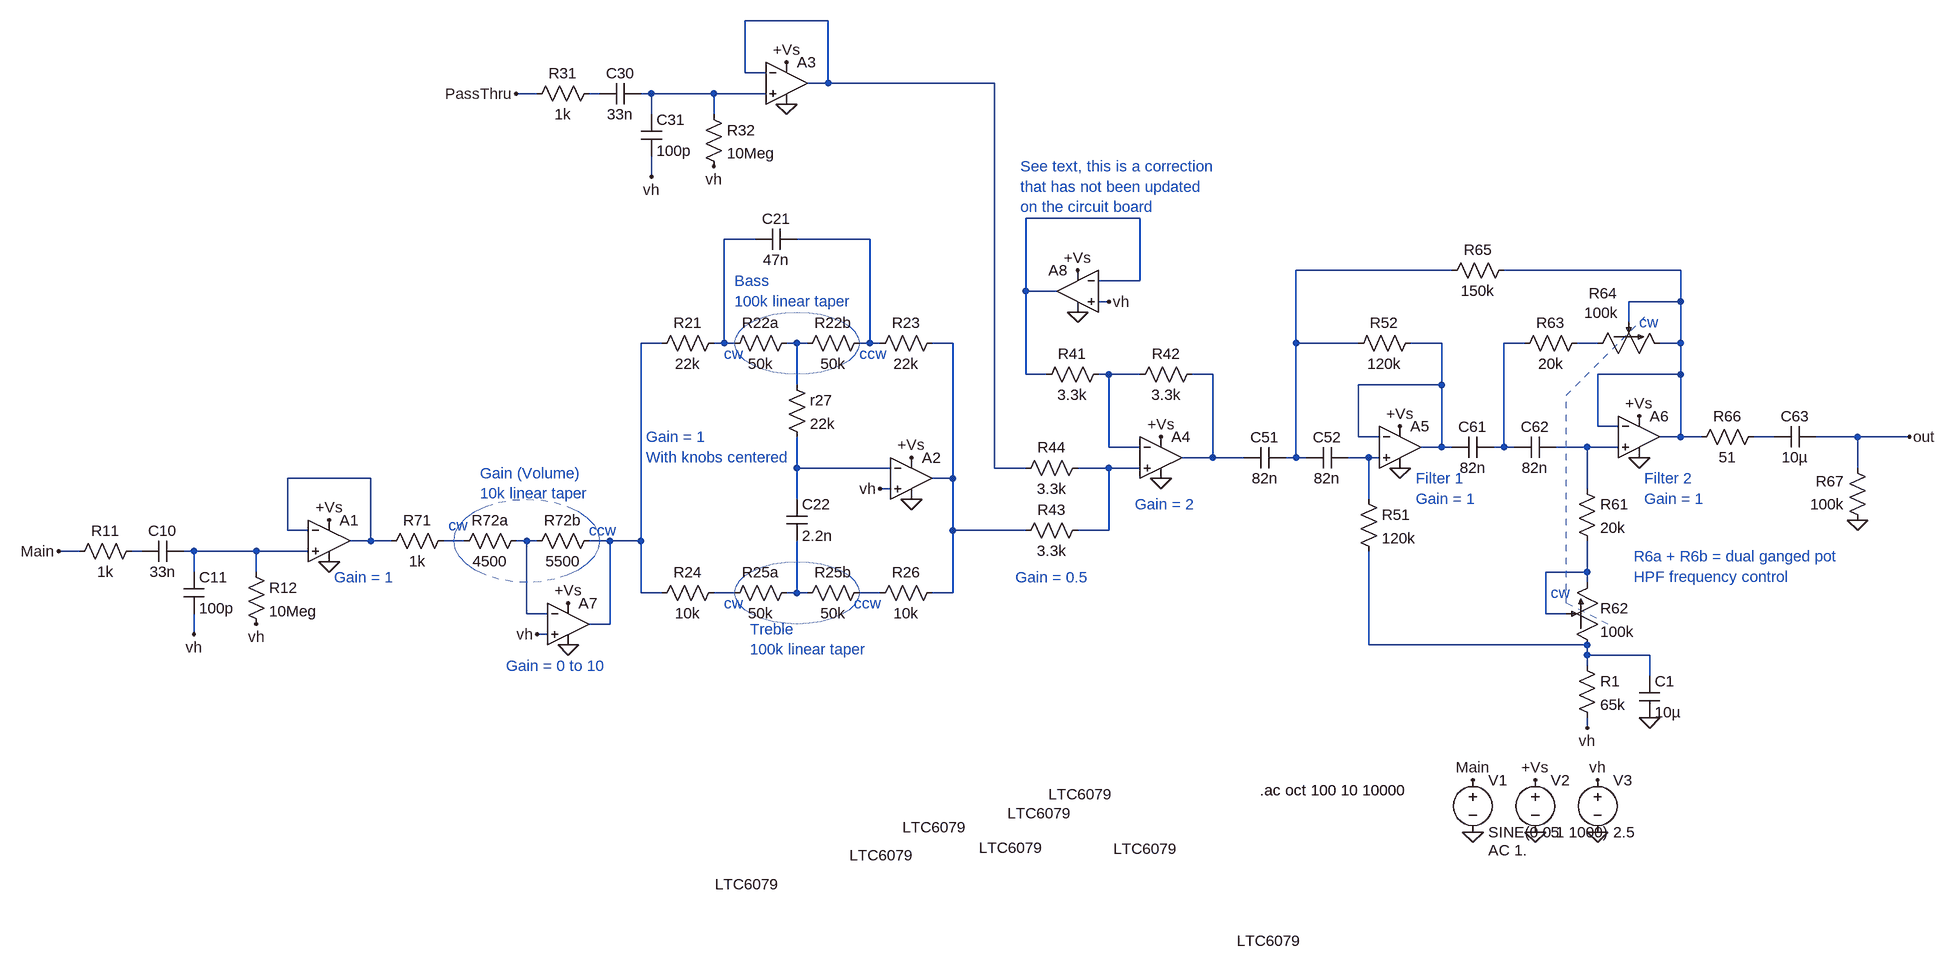
[diagram p0: schematic Channel Two model circuit v1.asc]
Channel Two model circuit v1.asc, the LTspice schematic file:
Version 4
SHEET 1 1044 1524
WIRE -1328 -544 -1456 -544
WIRE -1456 -464 -1456 -544
WIRE -1424 -464 -1456 -464
WIRE -1328 -448 -1328 -544
WIRE -1328 -448 -1360 -448
WIRE -1072 -448 -1328 -448
WIRE -1776 -432 -1808 -432
WIRE -1680 -432 -1696 -432
WIRE -1600 -432 -1616 -432
WIRE -1504 -432 -1600 -432
WIRE -1424 -432 -1504 -432
WIRE -1600 -400 -1600 -432
WIRE -1504 -400 -1504 -432
WIRE -1600 -304 -1600 -336
WIRE -848 -240 -1024 -240
WIRE -1440 -208 -1488 -208
WIRE -1264 -208 -1376 -208
WIRE -368 -160 -608 -160
WIRE -16 -160 -288 -160
WIRE -848 -144 -848 -240
WIRE -848 -144 -912 -144
WIRE -1024 -128 -1024 -240
WIRE -976 -128 -1024 -128
WIRE -896 -112 -912 -112
WIRE -16 -112 -16 -160
WIRE -16 -112 -96 -112
WIRE -96 -80 -96 -112
WIRE -1584 -48 -1616 -48
WIRE -1488 -48 -1488 -208
WIRE -1488 -48 -1504 -48
WIRE -1472 -48 -1488 -48
WIRE -1376 -48 -1392 -48
WIRE -1360 -48 -1376 -48
WIRE -1264 -48 -1264 -208
WIRE -1264 -48 -1280 -48
WIRE -1248 -48 -1264 -48
WIRE -1136 -48 -1168 -48
WIRE -608 -48 -608 -160
WIRE -512 -48 -608 -48
WIRE -384 -48 -432 -48
WIRE -256 -48 -288 -48
WIRE -144 -48 -176 -48
WIRE -16 -48 -16 -112
WIRE -16 -48 -48 -48
WIRE -1024 0 -1024 -128
WIRE -992 0 -1024 0
WIRE -896 0 -912 0
WIRE -848 0 -896 0
WIRE -736 0 -768 0
WIRE -16 0 -16 -48
WIRE -16 0 -144 0
WIRE -1376 16 -1376 -48
WIRE -384 16 -384 -48
WIRE -384 16 -512 16
WIRE -144 80 -144 0
WIRE -112 80 -144 80
WIRE -512 96 -512 16
WIRE -480 96 -512 96
WIRE -16 96 -16 0
WIRE -16 96 -48 96
WIRE 16 96 -16 96
WIRE 128 96 96 96
WIRE 256 96 192 96
WIRE 336 96 256 96
WIRE -896 112 -896 0
WIRE -848 112 -896 112
WIRE -384 112 -384 16
WIRE -384 112 -416 112
WIRE -368 112 -384 112
WIRE -288 112 -288 -48
WIRE -288 112 -304 112
WIRE -272 112 -288 112
WIRE -160 112 -208 112
WIRE -112 112 -160 112
WIRE -736 128 -736 0
WIRE -736 128 -784 128
WIRE -688 128 -736 128
WIRE -608 128 -608 -48
WIRE -608 128 -624 128
WIRE -592 128 -608 128
WIRE -496 128 -528 128
WIRE -480 128 -496 128
WIRE -1376 144 -1376 96
WIRE -1232 144 -1376 144
WIRE -1072 144 -1072 -448
WIRE -1024 144 -1072 144
WIRE -896 144 -944 144
WIRE -848 144 -896 144
WIRE 256 144 256 96
WIRE -2032 160 -2160 160
WIRE -1136 160 -1136 -48
WIRE -1136 160 -1168 160
WIRE -1232 176 -1248 176
WIRE -160 176 -160 112
WIRE -1376 192 -1376 144
WIRE -496 192 -496 128
WIRE -2160 240 -2160 160
WIRE -2128 240 -2160 240
WIRE -1136 240 -1136 160
WIRE -1024 240 -1136 240
WIRE -896 240 -896 144
WIRE -896 240 -944 240
WIRE -2032 256 -2032 160
WIRE -2032 256 -2064 256
WIRE -2000 256 -2032 256
WIRE -1888 256 -1920 256
WIRE -1792 256 -1808 256
WIRE -1776 256 -1792 256
WIRE -1664 256 -1696 256
WIRE -1616 256 -1616 -48
WIRE -1616 256 -1664 256
WIRE -2480 272 -2512 272
WIRE -2384 272 -2400 272
WIRE -2304 272 -2320 272
WIRE -2208 272 -2304 272
WIRE -2128 272 -2208 272
WIRE -2304 304 -2304 272
WIRE -2208 304 -2208 272
WIRE -160 304 -160 256
WIRE -160 304 -224 304
WIRE -160 320 -160 304
WIRE -1616 336 -1616 256
WIRE -1584 336 -1616 336
WIRE -1472 336 -1504 336
WIRE -1376 336 -1376 256
WIRE -1376 336 -1392 336
WIRE -1360 336 -1376 336
WIRE -1248 336 -1280 336
WIRE -1136 336 -1136 240
WIRE -1136 336 -1168 336
WIRE -1792 368 -1792 256
WIRE -1760 368 -1792 368
WIRE -224 368 -224 304
WIRE -192 368 -224 368
WIRE -1664 384 -1664 256
WIRE -1664 384 -1696 384
WIRE -2304 400 -2304 368
WIRE -1760 400 -1776 400
WIRE -496 416 -496 272
WIRE -160 416 -496 416
WIRE -160 432 -160 416
WIRE -64 432 -160 432
WIRE -160 448 -160 432
WIRE -64 464 -64 432
WIRE -160 544 -160 528
FLAG -240 704 0
FLAG -336 704 0
FLAG -336 624 Main
FLAG -240 624 +Vs
FLAG -816 160 0
FLAG -816 96 +Vs
FLAG -1392 -416 0
FLAG -1392 -480 +Vs
FLAG -448 144 0
FLAG -448 80 +Vs
FLAG -80 128 0
FLAG -80 64 +Vs
FLAG -1504 -320 vh
FLAG -160 544 vh
FLAG 256 224 0
FLAG -1600 -304 vh
FLAG -1200 192 0
FLAG -1200 128 +Vs
FLAG -1248 176 vh
FLAG -144 704 0
FLAG -144 624 vh
FLAG -1808 -432 PassThru
FLAG 336 96 out
FLAG -2096 288 0
FLAG -2096 224 +Vs
FLAG -2208 384 vh
FLAG -2304 400 vh
FLAG -2512 272 Main
FLAG -1728 416 0
FLAG -1728 352 +Vs
FLAG -1776 400 vh
FLAG -944 -96 0
FLAG -944 -160 +Vs
FLAG -896 -112 vh
FLAG -64 528 0
SYMBOL cap -304 96 R90
WINDOW 0 0 32 VBottom 2
WINDOW 3 32 32 VTop 2
SYMATTR InstName C61
SYMATTR Value 82n
SYMBOL cap -208 96 R90
WINDOW 0 0 32 VBottom 2
WINDOW 3 32 32 VTop 2
SYMATTR InstName C62
SYMATTR Value 82n
SYMBOL res -160 -64 R90
WINDOW 0 0 56 VBottom 2
WINDOW 3 32 56 VTop 2
SYMATTR InstName R63
SYMATTR Value 20k
SYMBOL res -176 160 R0
SYMATTR InstName R61
SYMATTR Value 20k
SYMBOL res -1520 -416 R0
SYMATTR InstName R32
SYMATTR Value 10Meg
SYMBOL res -1680 -448 R90
WINDOW 0 0 56 VBottom 2
WINDOW 3 32 56 VTop 2
SYMATTR InstName R31
SYMATTR Value 1k
SYMBOL POT -48 -64 R90
WINDOW 0 -61 65 VRight 2
WINDOW 3 -31 64 VRight 2
SYMATTR InstName R64
SYMATTR Value 100k
SYMBOL POT -176 320 R0
WINDOW 0 36 40 Left 2
WINDOW 3 36 76 Left 2
SYMATTR InstName R62
SYMATTR Value 100k
SYMBOL cap -1616 -400 R0
SYMATTR InstName C31
SYMATTR Value 100p
SYMBOL cap -624 112 R90
WINDOW 0 0 32 VBottom 2
WINDOW 3 32 32 VTop 2
SYMATTR InstName C51
SYMATTR Value 82n
SYMBOL cap -528 112 R90
WINDOW 0 0 32 VBottom 2
WINDOW 3 32 32 VTop 2
SYMATTR InstName C52
SYMATTR Value 82n
SYMBOL res -416 -64 R90
WINDOW 0 0 56 VBottom 2
WINDOW 3 32 56 VTop 2
SYMATTR InstName R52
SYMATTR Value 120k
SYMBOL res -512 176 R0
SYMATTR InstName R51
SYMATTR Value 120k
SYMBOL res -272 -176 R90
WINDOW 0 0 56 VBottom 2
WINDOW 3 32 56 VTop 2
SYMATTR InstName R65
SYMATTR Value 150k
SYMBOL voltage -336 608 R0
WINDOW 123 24 124 Left 2
WINDOW 39 0 0 Left 2
SYMATTR Value2 AC 1.
SYMATTR InstName V1
SYMATTR Value SINE(0 0.1 1000)
SYMBOL voltage -240 608 R0
WINDOW 123 0 0 Left 2
WINDOW 39 0 0 Left 2
SYMATTR InstName V2
SYMATTR Value 5
SYMBOL Opamps\\LTC6079 -816 128 R0
WINDOW 3 -73 602 Left 2
SYMATTR InstName A4
SYMBOL Opamps\\LTC6079 -1392 -448 R0
WINDOW 3 340 1123 Left 2
SYMATTR InstName A3
SYMBOL Opamps\\LTC6079 -448 112 R0
WINDOW 3 -648 616 Left 2
SYMATTR InstName A5
SYMBOL Opamps\\LTC6079 -80 96 R0
WINDOW 3 -909 550 Left 2
SYMATTR InstName A6
SYMBOL cap 192 80 R90
WINDOW 0 0 32 VBottom 2
WINDOW 3 32 32 VTop 2
SYMATTR InstName C63
SYMATTR Value 10µ
SYMBOL res 112 80 R90
WINDOW 0 0 56 VBottom 2
WINDOW 3 32 56 VTop 2
SYMATTR InstName R66
SYMATTR Value 51
SYMBOL res 272 240 R180
WINDOW 0 36 76 Left 2
WINDOW 3 36 40 Left 2
SYMATTR InstName R67
SYMATTR Value 100k
SYMBOL res -752 -16 R90
WINDOW 0 0 56 VBottom 2
WINDOW 3 32 56 VTop 2
SYMATTR InstName R42
SYMATTR Value 3.3k
SYMBOL res -896 -16 R90
WINDOW 0 0 56 VBottom 2
WINDOW 3 32 56 VTop 2
SYMATTR InstName R41
SYMATTR Value 3.3k
SYMBOL res -928 224 R90
WINDOW 0 0 56 VBottom 2
WINDOW 3 32 56 VTop 2
SYMATTR InstName R43
SYMATTR Value 3.3k
SYMBOL Opamps\\LTC6079 -1200 160 R0
WINDOW 3 -14 537 Left 2
SYMATTR InstName A2
SYMBOL res -1488 -64 R90
WINDOW 0 0 56 VBottom 2
WINDOW 3 32 56 VTop 2
SYMATTR InstName R21
SYMATTR Value 22k
SYMBOL res -1376 -64 R90
WINDOW 0 0 56 VBottom 2
WINDOW 3 32 56 VTop 2
SYMATTR InstName R22a
SYMATTR Value 50k
SYMBOL res -1264 -64 R90
WINDOW 0 0 56 VBottom 2
WINDOW 3 32 56 VTop 2
SYMATTR InstName R22b
SYMATTR Value 50k
SYMBOL res -1152 -64 R90
WINDOW 0 0 56 VBottom 2
WINDOW 3 32 56 VTop 2
SYMATTR InstName R23
SYMATTR Value 22k
SYMBOL res -1488 320 R90
WINDOW 0 0 56 VBottom 2
WINDOW 3 32 56 VTop 2
SYMATTR InstName R24
SYMATTR Value 10k
SYMBOL res -1376 320 R90
WINDOW 0 0 56 VBottom 2
WINDOW 3 32 56 VTop 2
SYMATTR InstName R25a
SYMATTR Value 50k
SYMBOL res -1264 320 R90
WINDOW 0 0 56 VBottom 2
WINDOW 3 32 56 VTop 2
SYMATTR InstName R25b
SYMATTR Value 50k
SYMBOL res -1152 320 R90
WINDOW 0 0 56 VBottom 2
WINDOW 3 32 56 VTop 2
SYMATTR InstName R26
SYMATTR Value 10k
SYMBOL res -1392 0 R0
SYMATTR InstName r27
SYMATTR Value 22k
SYMBOL cap -1392 192 R0
SYMATTR InstName C22
SYMATTR Value 2.2n
SYMBOL cap -1376 -224 R90
WINDOW 0 0 32 VBottom 2
WINDOW 3 32 32 VTop 2
SYMATTR InstName C21
SYMATTR Value 47n
SYMBOL voltage -144 608 R0
WINDOW 123 0 0 Left 0
WINDOW 39 0 0 Left 0
SYMATTR InstName V3
SYMATTR Value 2.5
SYMBOL cap -1616 -448 R90
WINDOW 0 0 32 VBottom 2
WINDOW 3 32 32 VTop 2
SYMATTR InstName C30
SYMATTR Value 33n
SYMBOL res -928 128 R90
WINDOW 0 0 56 VBottom 2
WINDOW 3 32 56 VTop 2
SYMATTR InstName R44
SYMATTR Value 3.3k
SYMBOL res -2224 288 R0
SYMATTR InstName R12
SYMATTR Value 10Meg
SYMBOL res -2384 256 R90
WINDOW 0 0 56 VBottom 2
WINDOW 3 32 56 VTop 2
SYMATTR InstName R11
SYMATTR Value 1k
SYMBOL cap -2320 304 R0
SYMATTR InstName C11
SYMATTR Value 100p
SYMBOL Opamps\\LTC6079 -2096 256 R0
WINDOW 3 594 528 Left 2
SYMATTR InstName A1
SYMBOL cap -2320 256 R90
WINDOW 0 0 32 VBottom 2
WINDOW 3 32 32 VTop 2
SYMATTR InstName C10
SYMATTR Value 33n
SYMBOL Opamps\\LTC6079 -1728 384 R0
WINDOW 3 433 356 Left 2
SYMATTR InstName A7
SYMBOL res -1792 240 R90
WINDOW 0 0 56 VBottom 2
WINDOW 3 32 56 VTop 2
SYMATTR InstName R72a
SYMATTR Value 4500
SYMBOL res -1680 240 R90
WINDOW 0 0 56 VBottom 2
WINDOW 3 32 56 VTop 2
SYMATTR InstName R72b
SYMATTR Value 5500
SYMBOL res -1904 240 R90
WINDOW 0 0 56 VBottom 2
WINDOW 3 32 56 VTop 2
SYMATTR InstName R71
SYMATTR Value 1k
SYMBOL Opamps\\LTC6079 -944 -128 M0
WINDOW 3 -345 999 Left 2
SYMATTR InstName A8
SYMBOL res -176 432 R0
SYMATTR InstName R1
SYMATTR Value 65k
SYMBOL cap -80 464 R0
SYMATTR InstName C1
SYMATTR Value 10µ
TEXT -664 640 Left 2 !.ac oct 100 10 10000
TEXT -80 -80 Left 2 ;cw
TEXT -216 336 Left 2 ;cw
TEXT -88 280 Left 2 ;R6a + R6b = dual ganged pot\nHPF frequency control
TEXT -424 160 Left 2 ;Filter 1\nGain = 1
TEXT -72 160 Left 2 ;Filter 2\nGain = 1
TEXT -1472 -144 Left 2 ;Bass\n100k linear taper
TEXT -1448 392 Left 2 ;Treble\n100k linear taper
TEXT -1488 -32 Left 2 ;cw
TEXT -1488 352 Left 2 ;cw
TEXT -1280 -32 Left 2 ;ccw
TEXT -1288 352 Left 2 ;ccw
TEXT -1864 152 Left 2 ;Gain (Volume)\n10k linear taper
TEXT -1912 232 Left 2 ;cw
TEXT -1696 240 Left 2 ;ccw
TEXT -2088 312 Left 2 ;Gain = 1
TEXT -1824 448 Left 2 ;Gain = 0 to 10
TEXT -1608 96 Left 2 ;Gain = 1\nWith knobs centered
TEXT -1040 312 Left 2 ;Gain = 0.5
TEXT -856 200 Left 2 ;Gain = 2
TEXT -1032 -320 Left 2 ;See text, this is a correction\nthat has not been updated\non the circuit board
LINE Normal -192 32 -64 -96 2
LINE Normal -192 352 -192 32 2
LINE Normal -128 384 -192 352 2
CIRCLE Normal -1280 0 -1472 -96 2
CIRCLE Normal -1280 384 -1472 288 2
CIRCLE Normal -1680 320 -1904 192 2

The netlist it stands for:
* Channel Two model circuit v1.asc
C61 N013 N012 82n
C62 N018 N013 82n
R63 N014 N013 20k
R61 N018 N027 20k
R32 N003 vh 10Meg
R31 N002 PassThru 1k
R64 N008 N014 N008 100k
R62 N027 N031 N027 100k
C31 N003 vh 100p
C51 N007 N016 82n
C52 N019 N007 82n
R52 N012 N007 120k
R51 N019 N031 120k
R65 N008 N007 150k
V1 Main 0 SINE(0 0.1 1000) AC 1.
V2 +Vs 0 5
XA4 N021 N015 +Vs 0 N016 LTC6078  ; LTC6079, pins In+ In- V+ V- OUT
XA3 N003 N001 +Vs 0 N001 LTC6078  ; LTC6079, pins In+ In- V+ V- OUT
XA5 N019 N012 +Vs 0 N012 LTC6078  ; LTC6079, pins In+ In- V+ V- OUT
XA6 N018 N008 +Vs 0 N008 LTC6078  ; LTC6079, pins In+ In- V+ V- OUT
C63 out N017 10µ
R66 N017 N008 51
R67 0 out 100k
R42 N016 N015 3.3k
R41 N015 N004 3.3k
R43 N021 N011 3.3k
XA2 vh N020 +Vs 0 N011 LTC6078  ; LTC6079, pins In+ In- V+ V- OUT
R21 N005 N009 22k
R22a N010 N005 50k
R22b N006 N010 50k
R23 N011 N006 22k
R24 N028 N009 10k
R25a N029 N028 50k
R25b N030 N029 50k
R26 N011 N030 10k
r27 N010 N020 22k
C22 N020 N029 2.2n
C21 N006 N005 47n
V3 vh 0 2.5
C30 N003 N002 33n
R44 N021 N001 3.3k
R12 N026 vh 10Meg
R11 N025 Main 1k
C11 N026 vh 100p
XA1 N026 N022 +Vs 0 N022 LTC6078  ; LTC6079, pins In+ In- V+ V- OUT
C10 N026 N025 33n
XA7 vh N024 +Vs 0 N009 LTC6078  ; LTC6079, pins In+ In- V+ V- OUT
R72a N024 N023 4500
R72b N009 N024 5500
R71 N023 N022 1k
XA8 vh N004 +Vs 0 N004 LTC6078  ; LTC6079, pins In+ In- V+ V- OUT
R1 N031 vh 65k
C1 N031 0 10µ
.ac oct 100 10 10000
* cw
* cw
* R6a + R6b = dual ganged pot
* HPF frequency control
* Filter 1
* Gain = 1
* Filter 2
* Gain = 1
* Bass
* 100k linear taper
* Treble
* 100k linear taper
* cw
* cw
* ccw
* ccw
* Gain (Volume)
* 10k linear taper
* cw
* ccw
* Gain = 1
* Gain = 0 to 10
* Gain = 1
* With knobs centered
* Gain = 0.5
* Gain = 2
* See text, this is a correction
* that has not been updated
* on the circuit board
.lib LTC5.lib
.backanno
.end